# EAGLE design G502 (EAGLE 6.6.0)
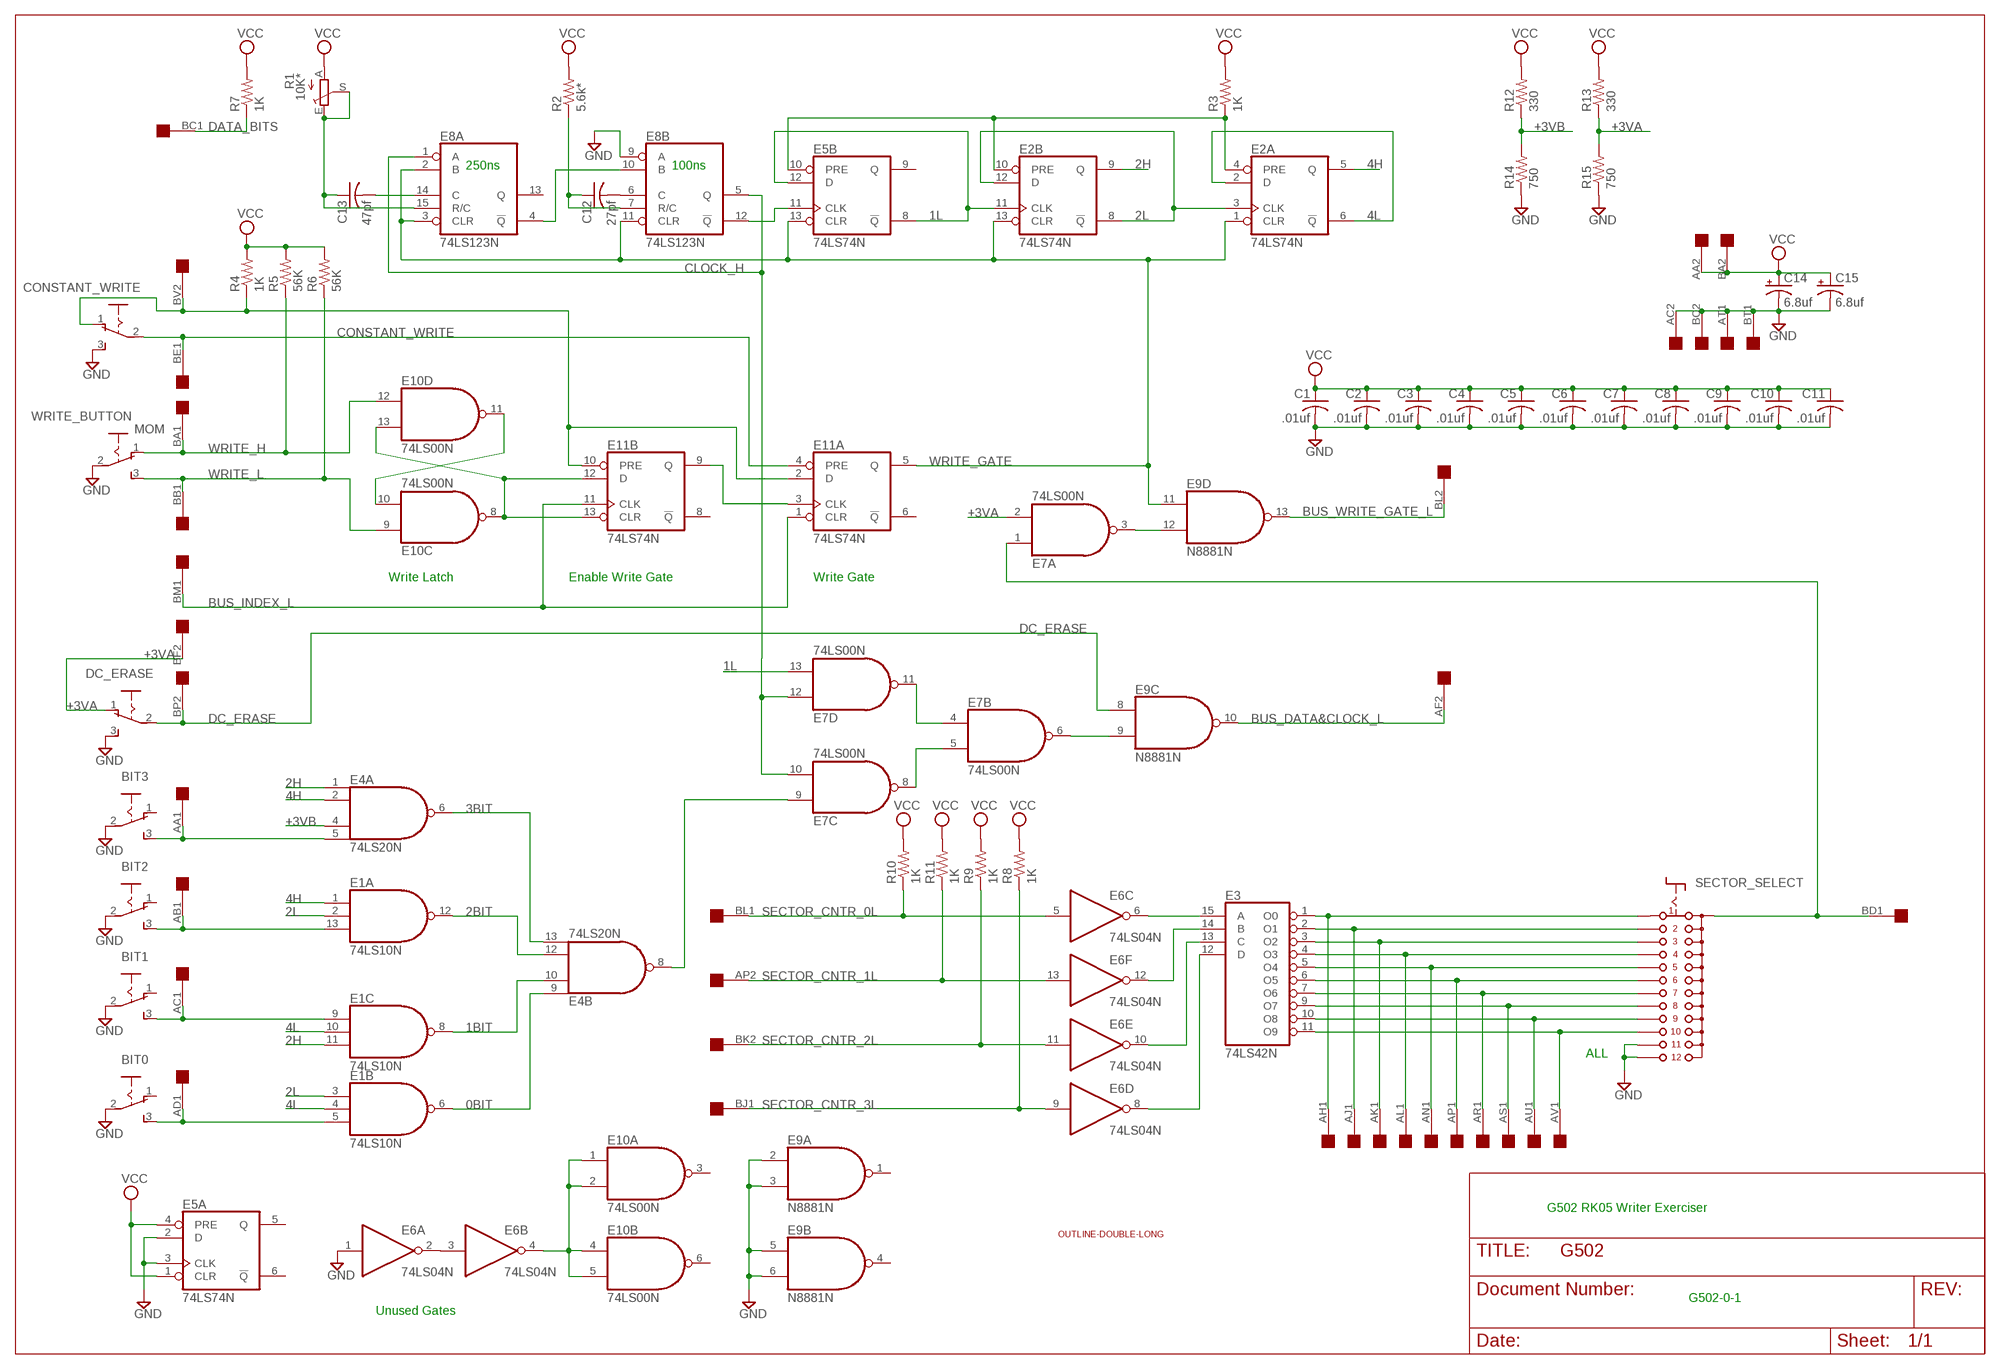
[diagram p0: schematic, sheet 1]

## Parts
AB04  DOUBLE  [EDGE-CON4]
BIT0  255SB  [255SB]
BIT1  255SB  [255SB]
BIT2  255SB  [255SB]
BIT3  255SB  [255SB]
C1  .01uf  C-US075-032X103  [C075-032X103]
C2  .01uf  C-US075-032X103  [C075-032X103]
C3  .01uf  C-US075-032X103  [C075-032X103]
C4  .01uf  C-US075-032X103  [C075-032X103]
C5  .01uf  C-US075-032X103  [C075-032X103]
C6  .01uf  C-US075-032X103  [C075-032X103]
C7  .01uf  C-US075-032X103  [C075-032X103]
C8  .01uf  C-US075-032X103  [C075-032X103]
C9  .01uf  C-US075-032X103  [C075-032X103]
C10  .01uf  C-US075-032X103  [C075-032X103]
C11  .01uf  C-US075-032X103  [C075-032X103]
C12  27pf  C-US075-032X103  [C075-032X103]
C13  47pf  C-US075-032X103  [C075-032X103]
C14  6.8uf  CPOL-USE25-9AXIAL  [E25-9]
C15  6.8uf  CPOL-USE25-9AXIAL  [E25-9]
CONSTANT_WRITE  255SB  [255SB]
DC_ERASE  255SB  [255SB]
E1  74LS10N  [DIL14]
E2  74LS74N  [DIL14]
E3  74LS42N  [DIL16]
E4  74LS20N  [DIL14]
E5  74LS74N  [DIL14]
E6  74LS04N  [DIL14]
E7  74LS00N  [DIL14]
E8  74LS123N  [DIL16]
E9  N8881N  [DIL14]
E10  74LS00N  [DIL14]
E11  74LS74N  [DIL14]
R1  10K*  TRIM_EU-B90P  [SP19L]
R2  5.6k*  R-US_0207/10  [0207/10]
R3  1K  R-US_0207/10  [0207/10]
R4  1K  R-US_0207/10  [0207/10]
R5  56K  R-US_0207/10  [0207/10]
R6  56K  R-US_0207/10  [0207/10]
R7  1K  R-US_0207/10  [0207/10]
R8  1K  R-US_0207/10  [0207/10]
R9  1K  R-US_0207/10  [0207/10]
R10  1K  R-US_0207/10  [0207/10]
R11  1K  R-US_0207/10  [0207/10]
R12  330  R-US_0207/10  [0207/10]
R13  330  R-US_0207/10  [0207/10]
R14  750  R-US_0207/10  [0207/10]
R15  750  R-US_0207/10  [0207/10]
SECTOR_SELECT  CK101X12  [CK101X12]
U$2  OUTLINE-DOUBLE-LONG  [DOUBLE-LONG]
WRITE_BUTTON  MOM  255SB  [255SB]

## Nets
0BIT: E1.6(B:O) E4.9(B:I0)
1.44MHZ: E5.11(B:CLK) E8.12(B:!Q)
1BIT: E1.8(C:O) E4.10(B:I1)
1L: E2.11(B:CLK) E5.8(B:!Q) E5.12(B:D) E7.13(D:I1)
2.88MHZ: E8.4(A:!Q) E8.10(B:B)
2BIT: E1.12(A:O) E4.12(B:I2)
2H: E1.11(C:I2) E2.9(B:Q) E4.1(A:I0)
2L: E1.2(A:I1) E1.3(B:I0) E2.3(A:CLK) E2.8(B:!Q) E2.12(B:D)
3BIT: E4.6(A:O) E4.13(B:I3)
4H: E1.1(A:I0) E2.5(A:Q) E4.2(A:I1)
4L: E1.4(B:I1) E1.10(C:I1) E2.2(A:D) E2.6(A:!Q)
+3VA: AB04.BF2 DC_ERASE.1(O) E7.2(A:I1) R13.1 R15.2
+3VB: E4.4(A:I2) R12.1 R14.2
BUS_DATA&CLOCK_L: AB04.AF2 E9.10(C:O)
BUS_INDEX_L: AB04.BM1 E11.1(A:CLR) E11.11(B:CLK)
BUS_WRITE_GATE_L: AB04.BL2 E9.13(D:O)
CLOCK_H: E7.10(C:I1) E7.12(D:I0) E8.1(A:A) E8.5(B:Q)
CONSTANT_WRITE: AB04.BE1 CONSTANT_WRITE.2(P) E11.4(A:PRE)
DATA_BITS: AB04.BC1 R7.1
DC_ERASE: AB04.BP2 DC_ERASE.2(P) E9.8(C:I0)
GND: AB04.AC2 AB04.AT1 AB04.BC2 AB04.BT1 BIT0.2(P) BIT1.2(P) BIT2.2(P) BIT3.2(P) C1.2 C2.2 C3.2 C4.2 C5.2 C6.2 C7.2 C8.2 C9.2 C10.2 C11.2 C14.- C15.- CONSTANT_WRITE.3(S) DC_ERASE.3(S) E5.2(A:D) E5.3(A:CLK) E6.1(A:I) E8.9(B:A) E9.2(A:I0) E9.3(A:I1) E9.5(B:I0) E9.6(B:I1) R14.1 R15.1 SECTOR_SELECT.11 SECTOR_SELECT.12 WRITE_BUTTON.2(P)
N$1: AB04.BV2 CONSTANT_WRITE.1(O) E11.2(A:D) E11.10(B:PRE) R4.1
N$2: E7.6(B:O) E9.9(C:I1)
N$3: E10.8(C:O) E10.13(D:I1) E11.12(B:D) E11.13(B:CLR)
N$4: E10.10(C:I1) E10.11(D:O)
N$5: E2.4(A:PRE) E2.10(B:PRE) E5.10(B:PRE) R3.1
N$6: E7.4(B:I0) E7.11(D:O)
N$7: E7.5(B:I1) E7.8(C:O)
N$8: E11.3(A:CLK) E11.9(B:Q)
N$9: E4.8(B:O) E7.9(C:I0)
N$10: AB04.AC1 BIT1.3(S) E1.9(C:I0)
N$11: C13.2 E8.14(A:C)
N$12: C12.2 E8.6(B:C)
N$13: C13.1 E8.15(A:R/C) R1.E R1.S
N$14: C12.1 E8.7(B:R/C) R2.1
N$15: E7.3(A:O) E9.12(D:I1)
N$16: AB04.AA1 BIT3.3(S) E4.5(A:I3)
N$17: AB04.AB1 BIT2.3(S) E1.13(A:I2)
N$18: AB04.AD1 BIT0.3(S) E1.5(B:I2)
N$19: AB04.AH1 E3.1(O0) SECTOR_SELECT.1
N$20: AB04.AJ1 E3.2(O1) SECTOR_SELECT.2
N$21: AB04.AK1 E3.3(O2) SECTOR_SELECT.3
N$22: AB04.AL1 E3.4(O3) SECTOR_SELECT.4
N$23: AB04.AN1 E3.5(O4) SECTOR_SELECT.5
N$24: AB04.AP1 E3.6(O5) SECTOR_SELECT.6
N$25: AB04.AR1 E3.7(O6) SECTOR_SELECT.7
N$26: AB04.AS1 E3.9(O7) SECTOR_SELECT.8
N$27: AB04.AU1 E3.10(O8) SECTOR_SELECT.9
N$28: AB04.AV1 E3.11(O9) SECTOR_SELECT.10
N$29: E3.15(A) E6.6(C:O)
N$30: E3.14(B) E6.12(F:O)
N$31: E3.13(C) E6.10(E:O)
N$32: E3.12(D) E6.8(D:O)
N$34: E6.2(A:O) E6.3(B:I)
N$36: E6.4(B:O) E10.1(A:I0) E10.2(A:I1) E10.4(B:I0) E10.5(B:I1)
SECTOR_CNTR_0L: AB04.BL1 E6.5(C:I) R10.1
SECTOR_CNTR_1L: AB04.AP2 E6.13(F:I) R11.1
SECTOR_CNTR_2L: AB04.BK2 E6.11(E:I) R9.1
SECTOR_CNTR_3L: AB04.BJ1 E6.9(D:I) R8.1
SECTOR_SELECT_L: AB04.BD1 E7.1(A:I0) SECTOR_SELECT.A
VCC: AB04.AA2 AB04.BA2 C1.1 C2.1 C3.1 C4.1 C5.1 C6.1 C7.1 C8.1 C9.1 C10.1 C11.1 C14.+ C15.+ E5.1(A:CLR) E5.4(A:PRE) R1.A R2.2 R3.2 R4.2 R5.2 R6.2 R7.2 R8.2 R9.2 R10.2 R11.2 R12.2 R13.2
WRITE_GATE: E2.1(A:CLR) E2.13(B:CLR) E5.13(B:CLR) E8.2(A:B) E8.3(A:CLR) E8.11(B:CLR) E9.11(D:I0) E11.5(A:Q)
WRITE_H: AB04.BA1 E10.12(D:I0) R5.1 WRITE_BUTTON.1(O)
WRITE_L: AB04.BB1 E10.9(C:I0) R6.1 WRITE_BUTTON.3(S)
Unconnected: AB04.AB2 AB04.AD2 AB04.AE1 AB04.AE2 AB04.AF1 AB04.AH2 AB04.AJ2 AB04.AK2 AB04.AL2 AB04.AM1 AB04.AM2 AB04.AN2 AB04.AR2 AB04.AS2 AB04.AT2 AB04.AU2 AB04.AV2 AB04.BB2 AB04.BD2 AB04.BE2 AB04.BF1 AB04.BH1 AB04.BH2 AB04.BJ2 AB04.BK1 AB04.BM2 AB04.BN1 AB04.BN2 AB04.BP1 AB04.BR1 AB04.BR2 AB04.BS1 AB04.BS2 AB04.BT2 AB04.BU1 AB04.BU2 AB04.BV1 BIT0.1(O) BIT1.1(O) BIT2.1(O) BIT3.1(O) E5.5(A:Q) E5.6(A:!Q) E5.9(B:Q) E8.13(A:Q) E9.1(A:O) E9.4(B:O) E10.3(A:O) E10.6(B:O) E11.6(A:!Q) E11.8(B:!Q)

## Notes on the sheet
- 250ns | 100ns
- Write Latch | Enable Write Gate | Write Gate
- ALL
- G502 RK05 Writer Exerciser
- G502-0-1
- Unused Gates

## Power pins joined to a net without a drawn wire
GND: E1.7(P:GND) E2.7(P:GND) E3.8(GND) E4.7(P:GND) E5.7(P:GND) E6.7(P:GND) E7.7(P:GND) E8.8(P:GND) E9.7(P:GND) E10.7(P:GND) E11.7(P:GND)
VCC: E1.14(P:VCC) E2.14(P:VCC) E3.16(VCC) E4.14(P:VCC) E5.14(P:VCC) E6.14(P:VCC) E7.14(P:VCC) E8.16(P:VCC) E9.14(P:VCC) E10.14(P:VCC) E11.14(P:VCC)

## Library data of the parts
AB04 = dec-con:DOUBLE: Double-Height DEC board
BIT0 BIT1-BIT3 CONSTANT_WRITE DC_ERASE WRITE_BUTTON = switch:255SB: SLIDING SWITCH Distributor Buerklin, 11G810
C1-C13 = rcl:C-US: CAPACITOR, American symbol
C14 C15 = rcl:CPOL-US: POLARIZED CAPACITOR, American symbol
E1 = 74xx-us:74*10: Triple 3-input NAND gate
E2 E5 E11 = 74xx-us:74*74: Dual D type positive edge triggered FLIP FLOP, preset and clear
E3 = 74xx-us:74*42: 4-line to 10-line DECODER (1-of-10)
E4 = 74xx-us:74*20: Dual 4-input NAND gate
E6 = 74xx-us:74*04: Hex INVERTER
E7 E10 = 74xx-us:74*00: Quad 2-input NAND gate
E8 = 74xx-us:74*123: Retriggerable monostable MULTIVIBRATOR
E9 = dec-con:N8881: Quad 2-input NAND gate, open collector
R1 = pot:TRIM_EU-: POTENTIOMETER
R2-R15 = rcl:R-US_: RESISTOR, American symbol
SECTOR_SELECT = switch:CK101X12: ROTARY SWITCH C&K
U$2 = dec-con:OUTLINE-*: Board outlines for DEC boards.

## Net classes
0 default: width 0.508 mm

## Board
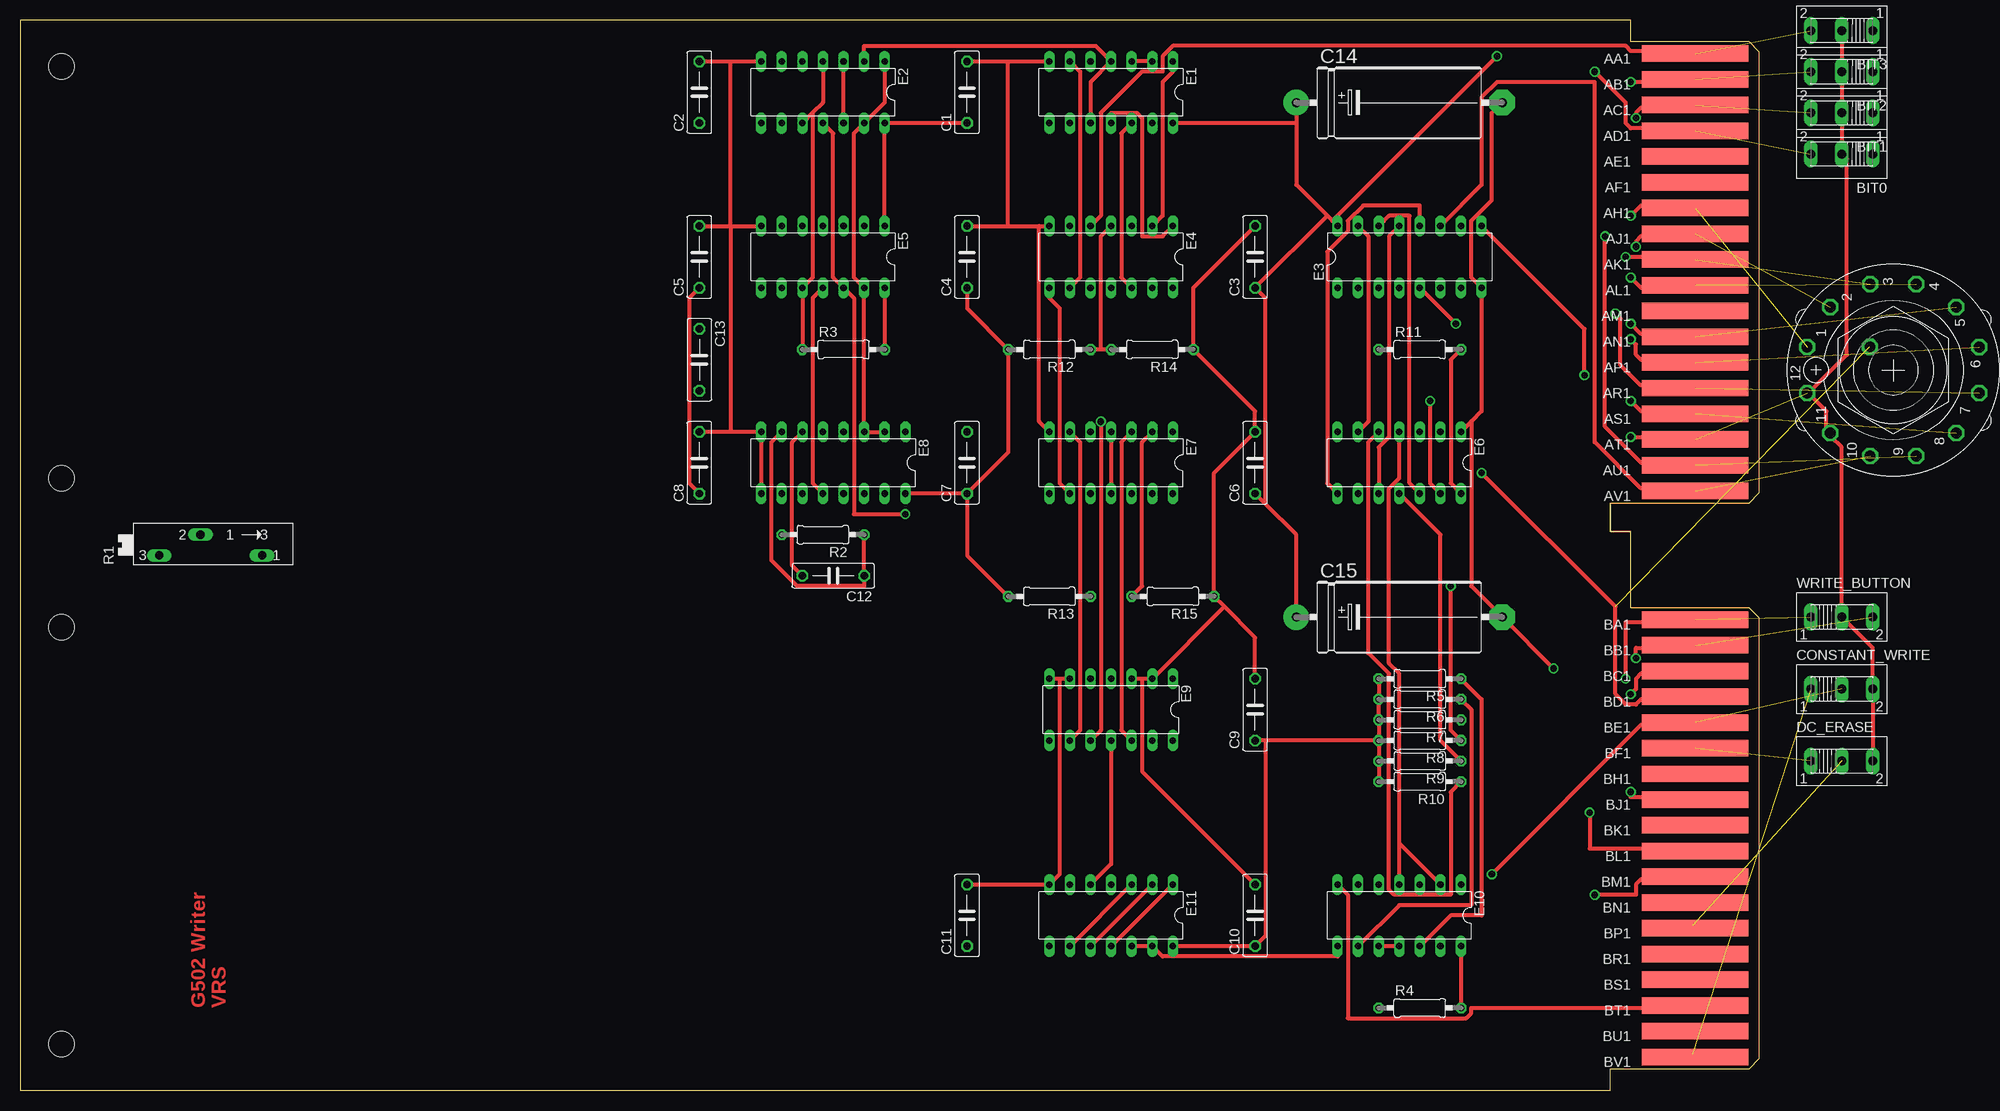
[diagram p1: board, top side]
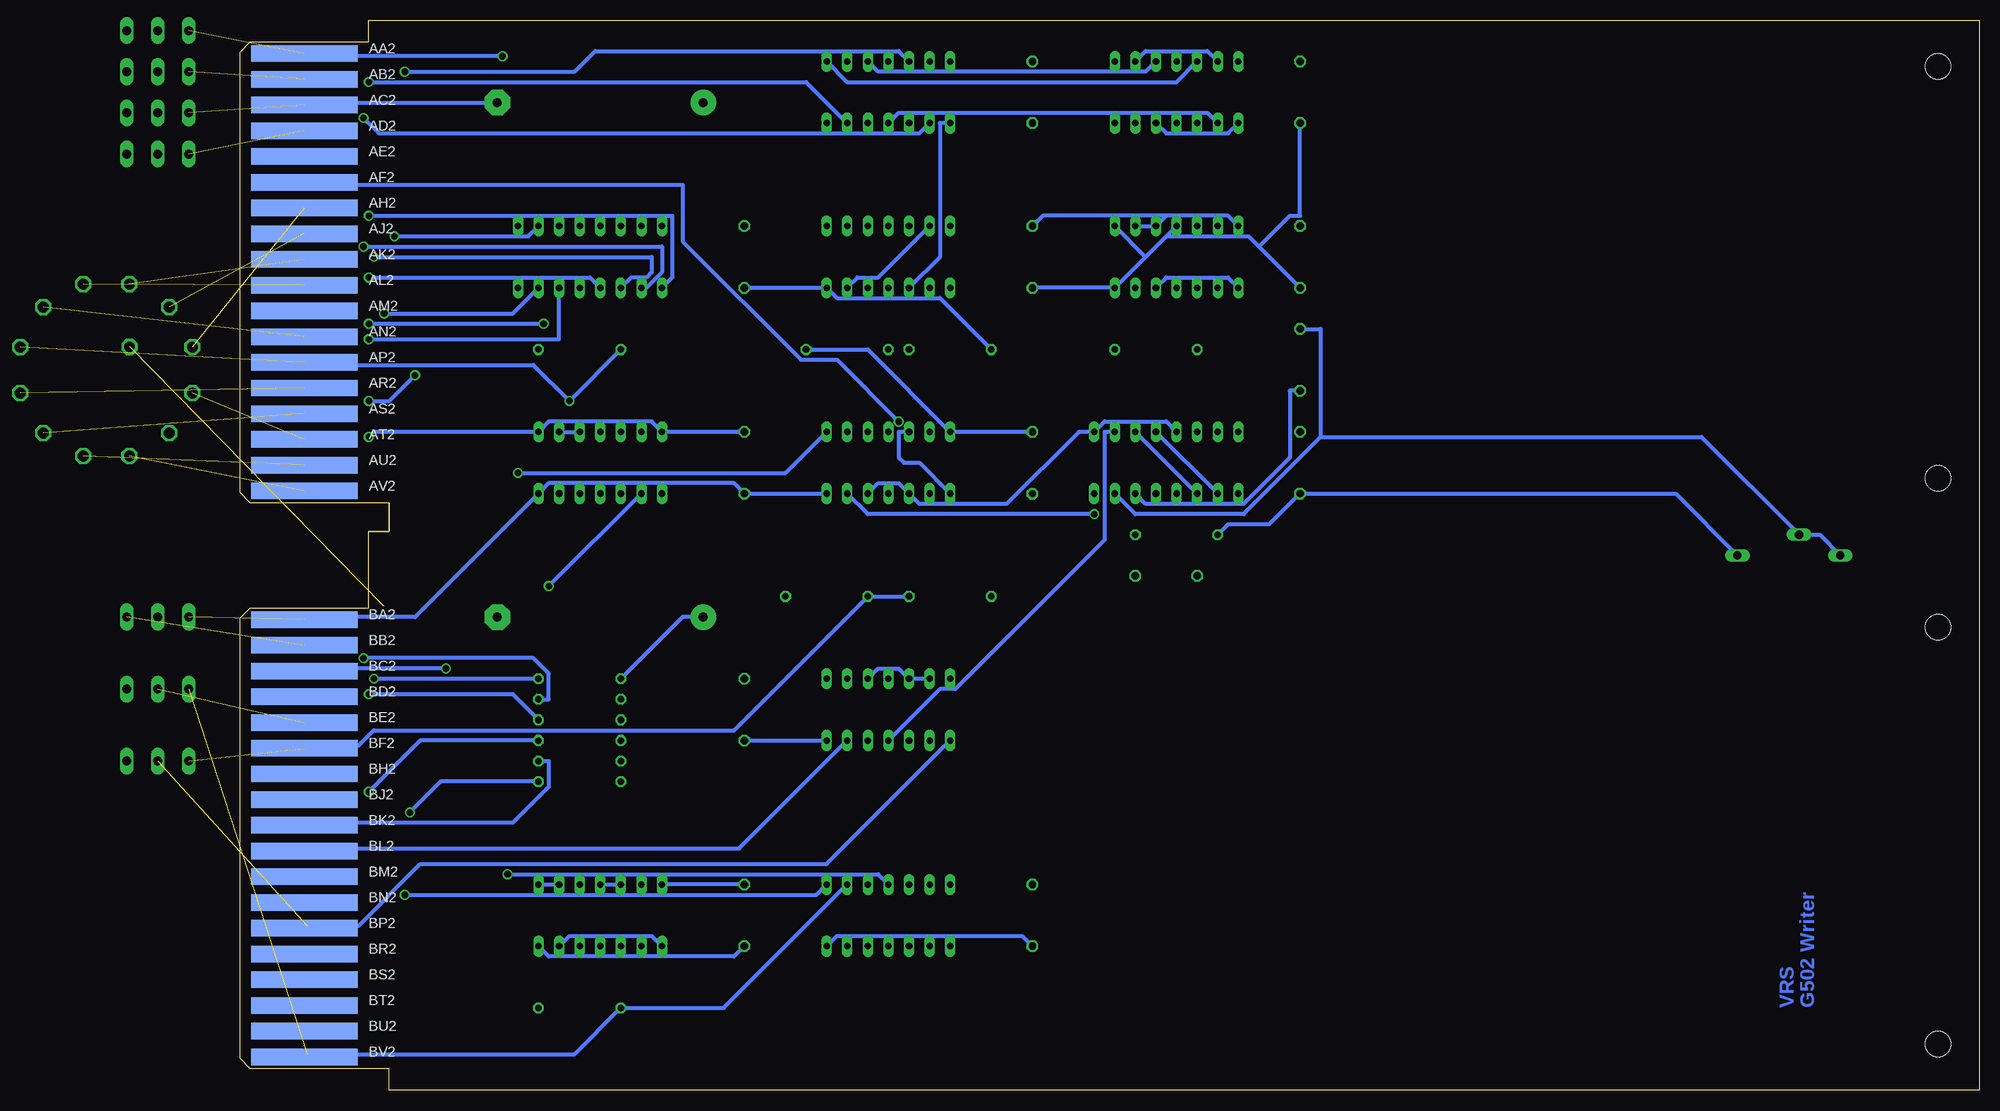
[diagram p2: board, bottom side, seen from below]

Size 214.63 x 132.08 mm. Coordinates in mm from the lower left corner, seen from the top.
Copper layers (1+16): Top 0.035mm / dielectric 1.5mm / Bottom 0.035mm
Design rules "16mils": minimum track width 16mil, minimum drill 32mil, track to track 15mil, track to pad 10mil, pad to pad 10mil, via to via 10mil, smd to smd 10mil, copper to edge 13mil, drill to drill 10mil, minimum pad ring 10mil, minimum via ring 8mil, stop-mask expansion 0mil, vias tented up to drill 0mil, thermal gap 10mil

### Footprints (pad centres in the part's own frame; a part is rotated, then mirrored left to right if it is on the bottom)
EDGE-CON4 = smd 13.106 x 2.032: AA1 7.938,4.128; AB1 7.938,7.303; AC1 7.938,10.477; AD1 7.938,13.652; AE1 7.938,16.828; AF1 7.938,20.003; AH1 7.938,23.177; AJ1 7.938,26.352; AK1 7.938,29.527; AL1 7.938,32.703; AM1 7.938,35.877; AN1 7.938,39.053; AP1 7.938,42.227; AR1 7.938,45.403; AS1 7.938,48.578; AT1 7.938,51.752; AU1 7.938,54.928; AV1 7.938,58.102; BA1 7.938,73.978; BB1 7.938,77.153; BC1 7.938,80.328; BD1 7.938,83.502; BE1 7.938,86.677; BF1 7.938,89.853; BH1 7.938,93.028; BJ1 7.938,96.203; BK1 7.938,99.377; BL1 7.938,102.552; BM1 7.938,105.728; BN1 7.938,108.903; BP1 7.938,112.078; BR1 7.938,115.252; BS1 7.938,118.427; BT1 7.938,121.603; BU1 7.938,124.778; BV1 7.938,127.953 | smd 13.106 x 2.032 bottom: AA2 7.938,4.128; AB2 7.938,7.303; AC2 7.938,10.477; AD2 7.938,13.652; AE2 7.938,16.828; AF2 7.938,20.003; AH2 7.938,23.177; AJ2 7.938,26.352; AK2 7.938,29.527; AL2 7.938,32.703; AM2 7.938,35.877; AN2 7.938,39.053; AP2 7.938,42.227; AR2 7.938,45.403; AS2 7.938,48.578; AT2 7.938,51.752; AU2 7.938,54.928; AV2 7.938,58.102; BA2 7.938,73.978; BB2 7.938,77.153; BC2 7.938,80.328; BD2 7.938,83.502; BE2 7.938,86.677; BF2 7.938,89.853; BH2 7.938,93.028; BJ2 7.938,96.203; BK2 7.938,99.377; BL2 7.938,102.552; BM2 7.938,105.728; BN2 7.938,108.903; BP2 7.938,112.078; BR2 7.938,115.252; BS2 7.938,118.427; BT2 7.938,121.603; BU2 7.938,124.778; BV2 7.938,127.953
255SB = drill 1.118 long: 1 -3.81,0; 2 0,0; 3 3.81,0
C075-032X103 = drill 0.914 octagon: 1 -3.81,0; 2 3.81,0
E25-9 = drill 1.118 pad 3.15: + -12.7,0 | drill 1.118 pad 3.15 octagon: - 12.7,0
DIL14 = drill 0.813 long: 1 -7.62,-3.81; 2 -5.08,-3.81; 3 -2.54,-3.81; 4 0,-3.81; 5 2.54,-3.81; 6 5.08,-3.81; 7 7.62,-3.81; 8 7.62,3.81; 9 5.08,3.81; 10 2.54,3.81; 11 0,3.81; 12 -2.54,3.81; 13 -5.08,3.81; 14 -7.62,3.81
DIL16 = drill 0.813 long: 1 -8.89,-3.81; 2 -6.35,-3.81; 3 -3.81,-3.81; 4 -1.27,-3.81; 5 1.27,-3.81; 6 3.81,-3.81; 7 6.35,-3.81; 8 8.89,-3.81; 9 8.89,3.81; 10 6.35,3.81; 11 3.81,3.81; 12 1.27,3.81; 13 -1.27,3.81; 14 -3.81,3.81; 15 -6.35,3.81; 16 -8.89,3.81
SP19L = drill 1.016 long: A 5.715,-1.27; E -6.985,-1.27; S -1.905,1.27
0207/10 = drill 0.813 octagon: 1 -5.08,0; 2 5.08,0
CK101X12 = drill 1.321 octagon: 1 -2.845,-10.617; 2 -7.772,-7.772; 3 -10.617,-2.845; 4 -10.617,2.845; 5 -7.772,7.772; 6 -2.845,10.617; 7 2.845,10.617; 8 7.772,7.772; 9 10.617,2.845; 10 10.617,-2.845; 11 7.772,-7.772; 12 2.845,-10.617; A -2.87,-2.87
DOUBLE-LONG = hole 3.175: 209.55,56.515; 209.55,5.715; 209.55,74.93; 209.55,126.365

### Placement (x,y rotation side)
AB04  214.63,132.08 180 top
BIT0  224.79,115.57 180 top  (outside the outline)
BIT1  224.79,120.65 180 top  (outside the outline)
BIT2  224.79,125.73 180 top  (outside the outline)
BIT3  224.79,130.81 180 top  (outside the outline)
C1  116.84,123.19 90 top
C2  83.82,123.19 90 top
C3  152.4,102.87 90 top
C4  116.84,102.87 90 top
C5  83.82,102.87 90 top
C6  152.4,77.47 90 top
C7  116.84,77.47 90 top
C8  83.82,77.47 90 top
C9  152.4,46.99 90 top
C10  152.4,21.59 90 top
C11  116.84,21.59 90 top
C12  100.33,63.5 180 top
C13  83.82,90.17 270 top
C14  170.18,121.92 0 top
C15  170.18,58.42 0 top
CONSTANT_WRITE  224.79,49.53 0 top  (outside the outline)
DC_ERASE  224.79,40.64 0 top  (outside the outline)
E1  134.62,123.19 180 top
E2  99.06,123.19 180 top
E3  171.45,102.87 0 top
E4  134.62,102.87 180 top
E5  99.06,102.87 180 top
E6  170.18,77.47 180 top
E7  134.62,77.47 180 top
E8  100.33,77.47 180 top
E9  134.62,46.99 180 top
E10  170.18,21.59 180 top
E11  134.62,21.59 180 top
R1  24.13,67.31 0 top
R2  99.06,68.58 180 top
R3  101.6,91.44 0 top
R4  172.72,10.16 0 top
R5  172.72,50.8 180 top
R6  172.72,48.26 180 top
R7  172.72,45.72 180 top
R8  172.72,43.18 180 top
R9  172.72,40.64 180 top
R10  172.72,38.1 180 top
R11  172.72,91.44 0 top
R12  127,91.44 180 top
R13  127,60.96 180 top
R14  139.7,91.44 180 top
R15  142.24,60.96 180 top
SECTOR_SELECT  231.14,88.9 270 top  (outside the outline)
U$2  214.63,132.08 180 top
WRITE_BUTTON  224.79,58.42 0 top  (outside the outline)

### Tracks (layer width: path | path; a pad name or v marks a point on that pad's centre or on a via)
0BIT
  Top 0.508: E4.9 130.81,100.33 130.81,125.73 E1.6
1.44MHZ
  Top 0.508: E8.12 97.79,74.93 97.79,97.79 E5.11
1BIT
  Bottom 0.508: E4.10 128.27,102.87 128.27,119.38 E1.8
1L  (via drill 0.81)
  Top 0.508: v109.22,71.12 102.87,71.12 102.87,97.79 E5.12 100.33,100.33 100.33,118.11 E2.11
  Bottom 0.508: E5.8 92.71,100.33 100.33,100.33 E5.12 | E7.13 137.16,71.12 v109.22,71.12
2.88MHZ
  Bottom 0.508: E8.4 E8.10
2BIT
  Top 0.508: E4.12 135.89,100.33 135.89,118.11 E1.12
2H
  Top 0.508: E4.1 140.97,105.41 138.43,105.41 138.43,120.02 137.79,120.65 134.62,120.65 E1.11
  Bottom 0.508: E2.9 95.25,120.65 133.35,120.65 E1.11
2L
  Top 0.508: E1.2 E1.3 | E2.12 E2.3
  Bottom 0.508: E2.8 92.71,118.11 100.33,118.11 E2.12 | E1.3 135.89,125.73 102.87,125.73 E2.3
3BIT
  Bottom 0.508: E4.6 135.89,100.33 138.43,100.33 E4.13
4H
  Top 0.508: E4.2 140.97,107.95 140.97,124.46 142.24,125.73 E1.1
  Bottom 0.508: E2.5 99.06,124.46 139.7,124.46 E1.1
4L
  Top 0.508: E1.10 132.08,124.46 E1.4 132.72,128.91 104.14,128.91 E2.2
  Bottom 0.508: E2.6 95.25,128.27 102.87,128.27 E2.2
+3VA  (1 unrouted)
  Top 0.508: E7.2 138.43,80.01 138.43,62.23 R15.2
  Bottom 0.508: R13.1 R15.2 153.67,44.45 198.12,44.45 200.03,42.55 206.38,42.55 AB04.BF2
+3VB
  Top 0.508: R14.2 133.35,91.44 | 133.35,91.44 R12.1 | E4.4 133.35,105.41 133.35,91.44
BUS_DATA&CLOCK_L  (via drill 0.81)
  Top 0.508: E9.10 133.35,44.45 v133.35,82.55
  Bottom 0.508: v133.35,82.55 140.97,90.17 145.41,90.17 160.02,104.78 160.02,111.76 206.38,111.76 AB04.AF2
BUS_INDEX_L  (via drill 0.81)
  Top 0.508: E11.1 E11.11 | v194.31,24.13 199.39,24.13 199.39,25.4 200.03,26.04 206.38,26.04 AB04.BM1
  Bottom 0.508: E11.1 143.51,24.13 v194.31,24.13
BUS_WRITE_GATE_L
  Bottom 0.508: E9.13 153.03,29.84 206.38,29.84 AB04.BL2
CLOCK_H
  Bottom 0.508: E7.12 135.89,74.93 133.35,74.93 E7.10 130.81,72.39 120.02,72.39 111.12,81.28 E8.1 107.95,82.55 100.33,82.55 E8.5
CONSTANT_WRITE  (via drill 0.81)  (1 unrouted)
  Top 0.508: v181.61,26.67 200.03,45.09 206.38,45.09 AB04.BE1
  Bottom 0.508: E11.4 135.89,26.67 v181.61,26.67
DATA_BITS  (via drill 0.81)
  Top 0.508: v198.75,48.9 199.39,49.53 199.39,50.8 200.03,51.44 206.38,51.44 AB04.BC1
  Bottom 0.508: R7.1 180.97,48.9 v198.75,48.9
DC_ERASE  (1 unrouted)
  Bottom 0.508: E9.8 142.24,27.94 192.41,27.94 200.03,20.32 206.38,20.32 AB04.BP2
GND  (via drill 0.81)  (1 unrouted)
  Top 0.508: BIT3.2 BIT2.2 BIT1.2 BIT0.2 225.43,114.94 225.43,90.81 220.98,86.36 SECTOR_SELECT.12 220.98,85.72 222.88,83.82 222.88,81.28 SECTOR_SELECT.11 223.52,80.64 224.79,79.38 WRITE_BUTTON.2 228.6,54.61 CONSTANT_WRITE.3 DC_ERASE.3 | 179.07,82.55 180.34,83.82 E3.8 179.07,100.33 179.07,107.31 181.61,109.86 181.61,120.65 C14.- | 179.07,82.55 E6.1 | 179.07,82.55 179.07,62.23 C15.- v189.23,52.07 | v198.75,80.64 206.38,80.64 AB04.AT1 | E8.9 E8.8 87.63,81.28 | 87.63,81.28 C8.2 | C1.2 121.92,127 | 121.92,127 E1.7 | C4.2 121.92,106.68 | 121.92,106.68 125.73,106.68 | 125.73,106.68 E4.7 | C2.2 87.63,127 | 87.63,127 E2.7 | C5.2 87.63,106.68 | 87.63,106.68 E5.7 | 87.63,106.68 87.63,127 | 121.92,106.68 121.92,127 | 87.63,106.68 87.63,81.28 | C3.2 144.78,99.06 R14.1 152.4,83.82 C6.2 147.32,76.2 R15.1 148.59,59.69 | C11.2 E11.7 128.27,26.67 128.27,50.8 | E9.6 128.27,50.8 | 128.27,50.8 E9.7 | 138.43,50.8 E9.2 148.59,59.69 | 138.43,50.8 E9.3 | 148.59,59.69 152.4,55.88 C9.2 | C10.2 138.43,39.37 138.43,50.8 | E10.7 163.83,24.13 163.83,8.89 178.44,8.89 179.07,9.53 179.07,10.16 206.38,10.16 AB04.BT1 | 125.73,106.68 125.73,82.55 E7.7
  Bottom 0.508: C14.- 206.38,121.92 AB04.AC2 | v189.23,52.07 206.38,52.07 AB04.BC2 | v198.75,80.64 198.12,81.28 E6.1 176.53,82.55 163.83,82.55 E6.7 C6.2 | E5.2 E5.3 100.33,107.95 | 100.33,107.95 92.71,107.95 E5.7 | C4.2 115.57,107.95 100.33,107.95 | C7.2 E7.7 137.16,91.44 R14.1 | C10.2 E10.7 | E9.6 E9.5 133.35,52.07 135.89,52.07 E9.3
N$1  (1 unrouted)
  Top 0.508: E11.2 E11.10
  Bottom 0.508: AB04.BV2 206.38,4.45 173.35,4.45 R4.1 154.94,10.16 E11.2
N$2
  Top 0.508: E9.9 130.81,44.45 130.81,80.01 E7.6
N$3
  Top 0.508: E11.12 E11.13 140.97,16.51 162.56,16.51 E10.8
  Bottom 0.508: E10.8 163.83,19.05 173.99,19.05 E10.13
N$4
  Top 0.508: E10.11 E10.10
N$5
  Top 0.508: R3.1 E5.10 97.79,100.33 97.79,120.65 | 97.79,120.65 99.06,121.92 E2.4 | 97.79,120.65 E2.10
N$6
  Top 0.508: E7.4 E7.11
N$7
  Bottom 0.508: E7.8 130.81,77.47 132.72,77.47 133.35,78.11 133.35,81.28 E7.5
N$8
  Top 0.508: E11.3 E11.9
N$9
  Top 0.508: E7.9 128.27,74.93 128.27,96.52 127,97.79 E4.8
N$10  (via drill 0.81)  (1 unrouted)
  Top 0.508: v199.39,120.02 199.39,120.65 200.03,121.28 206.38,121.28 AB04.AC1
  Bottom 0.508: E1.9 130.81,118.11 197.49,118.11 v199.39,120.02
N$11
  Bottom 0.508: E8.14 102.87,72.39 90.81,72.39 85.09,78.11 85.09,86.36 C13.2
N$12
  Top 0.508: E8.6 95.25,80.01 95.25,64.77 C12.2
N$13
  Bottom 0.508: R1.E 19.68,68.58 R1.S 34.29,80.64 81.28,80.64 | E8.15 104.14,71.12 90.81,71.12 81.28,80.64 | 81.28,80.64 81.28,93.98 C13.1
N$14
  Top 0.508: R2.1 C12.1 104.14,62.23 95.89,62.23 92.71,65.41 92.71,80.01 E8.7
N$15
  Top 0.508: E9.12 135.89,44.45 135.89,80.01 E7.3
N$16  (1 unrouted)
  Top 0.508: E4.5 133.35,107.95 133.35,120.65 138.43,125.73 140.97,125.73 140.97,127.64 142.24,128.91 198.12,128.91 198.75,128.27 206.38,128.27 AB04.AA1
N$17  (via drill 0.81)  (1 unrouted)
  Top 0.508: v198.75,124.46 206.38,124.46 AB04.AB1
  Bottom 0.508: E1.13 144.78,124.46 v198.75,124.46
N$18  (via drill 0.81)  (1 unrouted)
  Top 0.508: v194.31,125.73 198.12,121.92 198.12,119.38 198.75,118.75 206.38,118.75 AB04.AD1
  Bottom 0.508: E1.5 133.35,128.27 170.81,128.27 173.35,125.73 v194.31,125.73
N$19  (via drill 0.81)  (1 unrouted)
  Top 0.508: v198.75,107.95 200.03,109.22 206.38,109.22 AB04.AH1
  Bottom 0.508: E3.1 161.29,100.33 161.29,107.95 v198.75,107.95
N$20  (via drill 0.81)  (1 unrouted)
  Top 0.508: v199.39,104.14 199.39,104.78 200.03,105.41 206.38,105.41 AB04.AJ1
  Bottom 0.508: E3.2 164.47,99.06 162.56,100.97 162.56,104.14 v199.39,104.14
N$21  (via drill 0.81)  (1 unrouted)
  Top 0.508: v198.12,102.87 206.38,102.87 AB04.AK1
  Bottom 0.508: E3.3 166.37,100.33 164.47,100.33 163.83,100.97 163.83,102.87 v198.12,102.87
N$22  (via drill 0.81)  (1 unrouted)
  Top 0.508: v198.75,100.33 200.03,99.06 206.38,99.06 AB04.AL1
  Bottom 0.508: E3.4 171.45,100.33 v198.75,100.33
N$23  (via drill 0.81)  (1 unrouted)
  Top 0.508: v177.16,94.61 E3.5 | v198.75,94.61 200.03,93.34 206.38,93.34 AB04.AN1
  Bottom 0.508: v198.75,94.61 v177.16,94.61
N$24  (via drill 0.81)  (1 unrouted)
  Top 0.508: v198.75,92.71 199.39,92.08 199.39,90.81 200.03,90.17 206.38,90.17 AB04.AP1
  Bottom 0.508: E3.6 175.26,92.71 v198.75,92.71
N$25  (via drill 0.81)  (1 unrouted)
  Top 0.508: v196.85,95.89 197.49,95.25 197.49,89.53 200.03,87 206.38,87 AB04.AR1
  Bottom 0.508: E3.7 180.97,95.89 v196.85,95.89
N$26  (via drill 0.81)  (1 unrouted)
  Top 0.508: E3.9 193.04,93.98 v193.04,88.27 | v198.75,85.09 200.03,83.82 206.38,83.82 AB04.AS1
  Bottom 0.508: v193.04,88.27 196.22,85.09 v198.75,85.09
N$27  (via drill 0.81)  (1 unrouted)
  Top 0.508: v195.58,105.41 195.58,81.92 200.03,77.47 206.38,77.47 AB04.AU1
  Bottom 0.508: E3.10 179.07,105.41 v195.58,105.41
N$28  (1 unrouted)
  Top 0.508: E3.11 180.34,111.76 180.34,122.56 182.25,124.46 194.31,124.46 194.31,80.01 200.03,74.3 206.38,74.3 AB04.AV1
N$29
  Top 0.508: E6.6 166.37,82.55 166.37,105.41 E3.15
N$30
  Top 0.508: E3.14 168.91,107.95 171.45,107.95 171.45,74.93 E6.12
N$31
  Top 0.508: E6.10 167.64,79.38 168.91,80.64 168.91,105.41 E3.13
N$32
  Top 0.508: E6.8 161.29,74.93 161.29,103.5 163.83,106.05 163.83,107.31 165.74,109.22 172.72,109.22 E3.12
N$34
  Bottom 0.508: E6.2 E6.3
N$36
  Top 0.508: E6.4 170.18,75.56 168.91,74.3 168.91,52.7 170.18,51.44 170.18,30.48 | E10.4 170.18,30.48 | 170.18,30.48 E10.2
  Bottom 0.508: E10.1 E10.2 | E10.4 E10.5
SECTOR_CNTR_0L  (via drill 0.81)
  Top 0.508: E6.5 166.37,80.01 166.37,53.98 168.91,51.44 168.91,24.77 169.54,24.13 176.53,24.13 176.53,36.83 R10.1 | v193.68,34.29 193.68,29.84 206.38,29.84 AB04.BL1
  Bottom 0.508: v193.68,34.29 189.87,38.1 R10.1
SECTOR_CNTR_1L  (via drill 0.81)
  Top 0.508: E6.13 173.99,74.93 v173.99,85.09
  Bottom 0.508: R11.1 v173.99,85.09 178.44,89.53 206.38,89.53 AB04.AP2
SECTOR_CNTR_2L
  Top 0.508: E6.11 175.26,68.58 175.26,43.18 R9.1
  Bottom 0.508: R9.1 176.53,40.64 176.53,37.47 180.97,33.02 206.38,33.02 AB04.BK2
SECTOR_CNTR_3L  (via drill 0.81)
  Top 0.508: v176.53,62.23 176.53,44.45 R8.1 | v198.75,36.83 198.75,36.2 206.38,36.2 AB04.BJ1
  Bottom 0.508: v176.53,62.23 E6.9 | v198.75,36.83 192.41,43.18 R8.1
SECTOR_SELECT_L  (via drill 0.81)  (1 unrouted)
  Top 0.508: v180.34,76.2 196.85,59.69 196.85,48.9 198.12,47.62 199.39,47.62 200.03,48.26 206.38,48.26 AB04.BD1
  Bottom 0.508: E7.1 147.32,76.2 v180.34,76.2
VCC  (via drill 0.81)
  Top 0.508: R13.2 116.84,66.04 C7.1 | C7.1 E8.16 | C4.1 116.84,96.52 R12.2 121.92,78.74 C7.1 | C1.1 E2.14 E5.1 | E5.14 R3.2 | C8.1 82.55,74.93 82.55,97.79 C5.1 | 161.29,107.95 157.48,111.76 157.48,119.38 | 161.29,107.95 161.93,107.31 | 161.93,107.31 E3.16 | C14.+ 157.48,119.38 | 157.48,119.38 E1.14 | 161.29,107.95 C3.1 153.67,97.79 153.67,72.39 | 161.93,107.31 v182.25,127.64 | E10.14 R4.2 | E11.14 C10.1 153.67,19.05 153.67,43.18 | R5.2 R6.2 R7.2 R8.2 | R10.2 R9.2 R8.2 | R8.2 153.67,43.18 | 153.67,43.18 C9.1 | E6.14 176.53,74.93 176.53,90.17 R11.2 | 153.67,72.39 157.48,68.58 C15.+ | 153.67,72.39 C6.1
  Bottom 0.508: R2.2 92.71,69.85 87.63,69.85 C8.1 37.47,73.66 R1.A | 102.87,102.87 E5.14 C4.1 | 102.87,102.87 100.33,105.41 | 100.33,105.41 E5.4 | 102.87,102.87 E5.1 | 88.9,104.14 90.17,105.41 100.33,105.41 | 88.9,104.14 C5.1 | C2.1 83.82,107.95 85.09,107.95 88.9,104.14 | C3.1 E4.14 140.97,97.79 128.27,97.79 R12.2 | v182.25,127.64 206.38,127.64 AB04.AA2 | C11.1 118.11,19.05 140.97,19.05 E11.14 | E10.14 176.53,16.51 153.67,16.51 C10.1 | C9.1 E9.14 | E7.14 C6.1 153.67,74.93 176.53,74.93 E6.14 193.04,58.42 206.38,58.42 AB04.BA2 | R5.2 160.02,58.42 C15.+
WRITE_GATE
  Top 0.508: E11.5 134.62,27.94 E9.11 | E2.1 106.68,121.92 E2.13 102.87,118.11 102.87,100.33 E5.13 E8.3 E8.2
  Bottom 0.508: E8.3 E8.11 | E9.11 128.27,49.53 126.36,49.53 107.95,67.94 107.95,81.28 E8.2
WRITE_H  (via drill 0.81)  (1 unrouted)
  Top 0.508: E10.12 176.53,21.59 180.34,21.59 180.34,48.26 R5.1 | v198.12,50.8 198.12,57.78 206.38,57.78 AB04.BA1
  Bottom 0.508: R5.1 v198.12,50.8
WRITE_L  (via drill 0.81)  (1 unrouted)
  Top 0.508: E10.9 170.18,22.86 179.07,22.86 179.07,46.99 R6.1 | v199.39,53.34 199.39,54.61 206.38,54.61 AB04.BB1
  Bottom 0.508: v199.39,53.34 178.44,53.34 176.53,51.44 176.53,48.26 R6.1

### Text on the board
Top: G502 Writer | VRS
Bottom: G502 Writer | VRS